# Altium schematic sheet ADS129x.SchDoc: ECG AFE (ADS129x)
size Letter; DocumentNumber: 9; Revision: 2.0; SheetNumber: 9; SheetTotal: 9; Designer1: Léonard L. Gagnon; Designer2: -
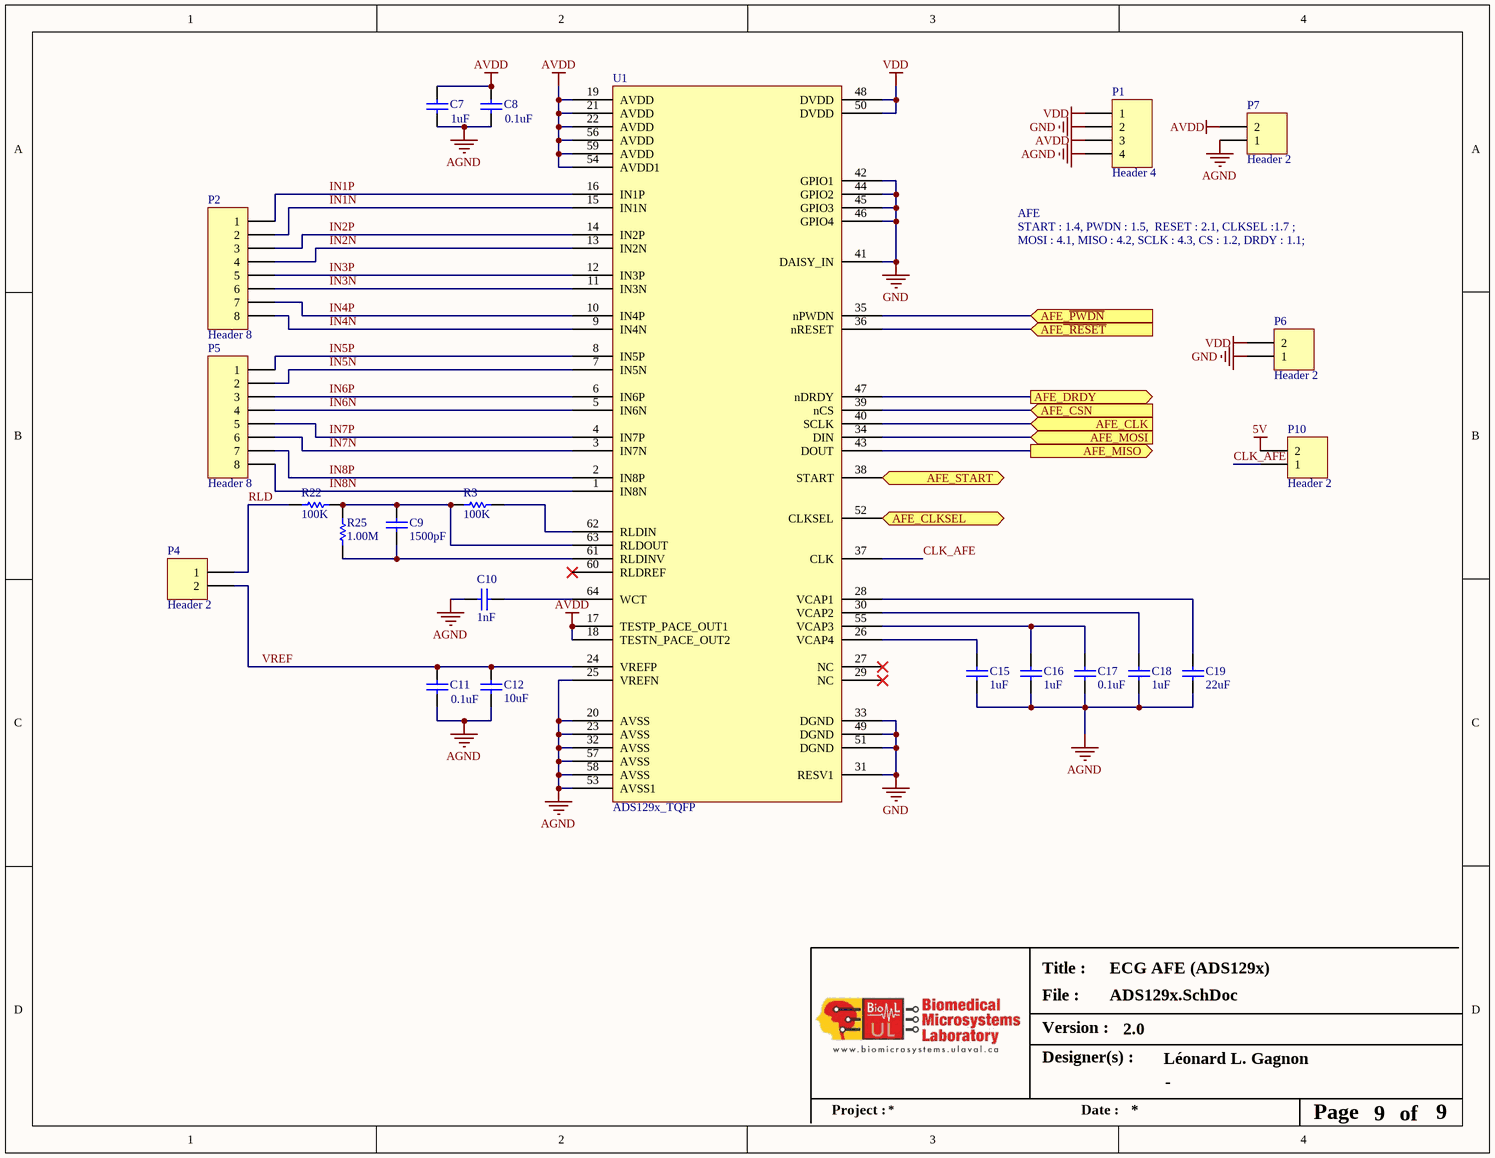
[diagram p0: ADS129x.SchDoc]

## Parts
C7  value 1uF  [0402]  (hidden comment: Cap)
C8  value 0.1uF  [0402]  (hidden comment: Cap)
C9  value 1500pF  [0402]  (hidden comment: Cap)
C10  value 1nF  [0402]  (hidden comment: Cap)
C11  value 0.1uF  [0402]  (hidden comment: Cap)
C12  value 10uF  [0402]
C15  value 1uF  [0402]  (hidden comment: Cap)
C16  value 1uF  [0402]  (hidden comment: Cap)
C17  value 0.1uF  [0402]  (hidden comment: Cap)
C18  value 1uF  [0402]  (hidden comment: Cap)
C19  value 22uF  [0402]  (hidden comment: Cap)
P1  Header 4  [HDR1X4]
P2  Header 8  [HDR1X8]
P4  Header 2  [HDR1X2]
P5  Header 8  [HDR1X8]
P6  Header 2  [HDR1X2]
P7  Header 2  [HDR1X2]
P10  Header 2  [HDR1X2]
R3  value 100K  [0402]  (hidden comment: Res1)
R22  value 100K  [0402]  (hidden comment: Res1)
R25  value 1.00M  [0402]  (hidden comment: Res1)
U1  ADS129x_TQFP  [PQFP-G64]

## Ports
AFE_CLK (in), AFE_CLKSEL (in), AFE_CSN (in), AFE_DRDY (out), AFE_MISO (out), AFE_MOSI (in), AFE_START (in), AFE_~{PWDN} (in), AFE~{_RESET} (in)

## Nets
5V: P10.2
AGND: C7.1 C8.1 C10.2 C11.1 C12.1 C15.2 C16.2 C17.2 C18.2 C19.2 P1.4 P7.1 U1.20(AVSS) U1.23(AVSS) U1.25(VREFN) U1.32(AVSS) U1.53(AVSS1) U1.57(AVSS) U1.58(AVSS)
AVDD: C7.2 C8.2 P1.3 P7.2 U1.17(TESTP_PACE_OUT1) U1.18(TESTN_PACE_OUT2) U1.19(AVDD) U1.21(AVDD) U1.22(AVDD) U1.54(AVDD1) U1.56(AVDD) U1.59(AVDD)
GND: P1.2 P6.1 U1.31(RESV1) U1.33(DGND) U1.41(DAISY_IN) U1.42(GPIO1) U1.44(GPIO2) U1.45(GPIO3) U1.46(GPIO4) U1.49(DGND) U1.51(DGND)
VDD: P1.1 P6.2 U1.48(DVDD) U1.50(DVDD)
AFE~{_RESET}: U1.36(nRESET) ; port AFE~{_RESET}
AFE_CLK: U1.40(SCLK) ; port AFE_CLK
AFE_CLKSEL: U1.52(CLKSEL) ; port AFE_CLKSEL
AFE_CSN: U1.39(nCS) ; port AFE_CSN
AFE_DRDY: U1.47(nDRDY) ; port AFE_DRDY
AFE_MISO: U1.43(DOUT) ; port AFE_MISO
AFE_MOSI: U1.34(DIN) ; port AFE_MOSI
AFE_~{PWDN}: U1.35(nPWDN) ; port AFE_~{PWDN}
AFE_START: U1.38(START) ; port AFE_START
CLK_AFE: P10.1 U1.37(CLK)
IN1N: P2.2 U1.15(IN1N)
IN1P: P2.1 U1.16(IN1P)
IN2N: P2.4 U1.13(IN2N)
IN2P: P2.3 U1.14(IN2P)
IN3N: P2.6 U1.11(IN3N)
IN3P: P2.5 U1.12(IN3P)
IN4N: P2.8 U1.9(IN4N)
IN4P: P2.7 U1.10(IN4P)
IN5N: P5.2 U1.7(IN5N)
IN5P: P5.1 U1.8(IN5P)
IN6N: P5.4 U1.5(IN6N)
IN6P: P5.3 U1.6(IN6P)
IN7N: P5.6 U1.3(IN7N)
IN7P: P5.5 U1.4(IN7P)
IN8N: P5.8 U1.1(IN8N)
IN8P: P5.7 U1.2(IN8P)
RLD: P4.1 R22.2
VREF: C11.2 C12.2 P4.2 U1.24(VREFP)
NetC9_1: C9.1 R25.2 U1.61(RLDINV)
NetC9_2: C9.2 R3.2 R22.1 R25.1 U1.63(RLDOUT)
NetC10_1: C10.1 U1.64(WCT)
NetC15_1: C15.1 U1.26(VCAP4)
NetC16_1: C16.1 C17.1 U1.55(VCAP3)
NetC18_1: C18.1 U1.30(VCAP2)
NetC19_1: C19.1 U1.28(VCAP1)
NetR3_1: R3.1 U1.62(RLDIN)

Not connected (* = marked no-connect by the designer): U1 27(NC)* 29(NC)* 60(RLDREF)*

## Notes on the sheet
- AFE
- START : 1.4, PWDN : 1.5,  RESET : 2.1, CLKSEL :1.7 ;
- MOSI : 4.1, MISO : 4.2, SCLK : 4.3, CS : 1.2, DRDY : 1.1;
- Title :
- Version :
- File :
- Designer(s) :
- Project :
- Date :
- Page
- of

## Library data of the parts
C7-C11 C15-C19 = Cap: Capacitor
C12 = Cap Semi: Capacitor (Semiconductor SIM Model)
P1 = Header 4: Header, 4-Pin; LatestRevisionDate: 17-Jul-2002; LatestRevisionNote: Re-released for DXP Platform.; Publisher: Altium Limited
P2 P5 = Header 8: Header, 8-Pin; LatestRevisionDate: 17-Jul-2002; LatestRevisionNote: Re-released for DXP Platform.; Publisher: Altium Limited
P4 P6 P7 P10 = Header 2: Header, 2-Pin; LatestRevisionDate: 17-Jul-2002; LatestRevisionNote: Re-released for DXP Platform.; Publisher: Altium Limited
R3 R22 R25 = Res1: Resistor